# EAGLE design mainboard (EAGLE 9.6.2)
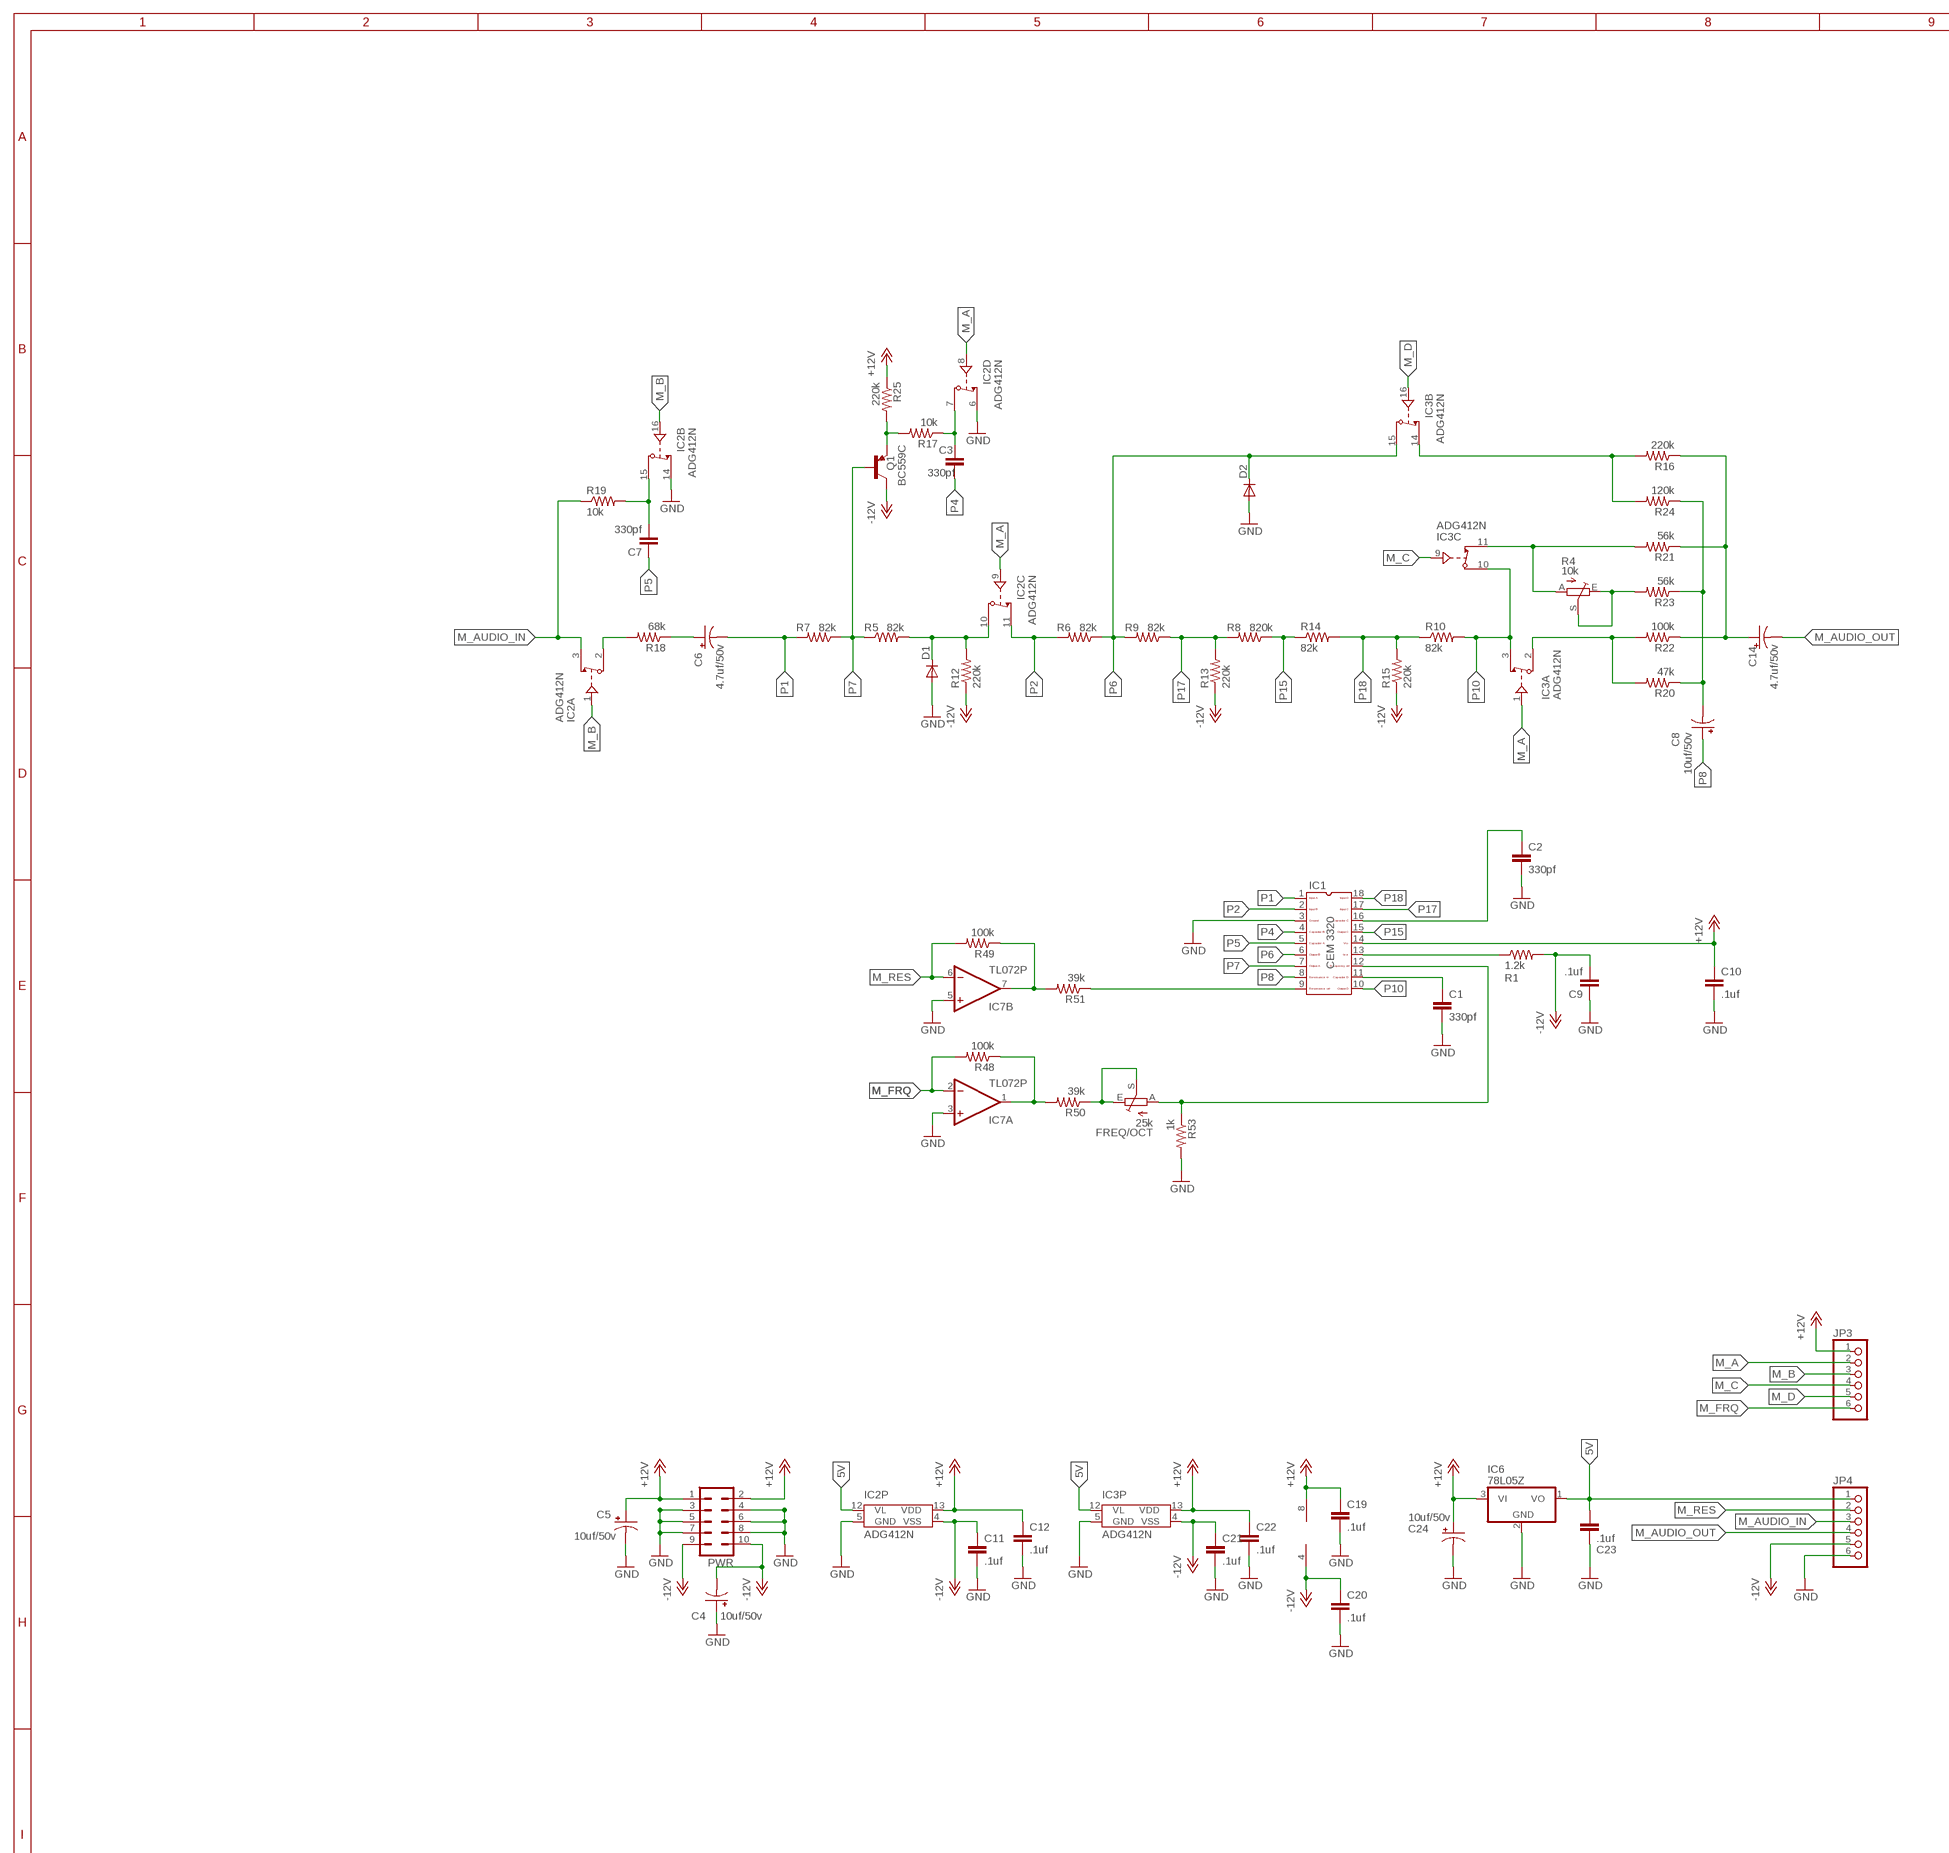
[diagram p0: schematic, sheet 1, part 1 of 2]
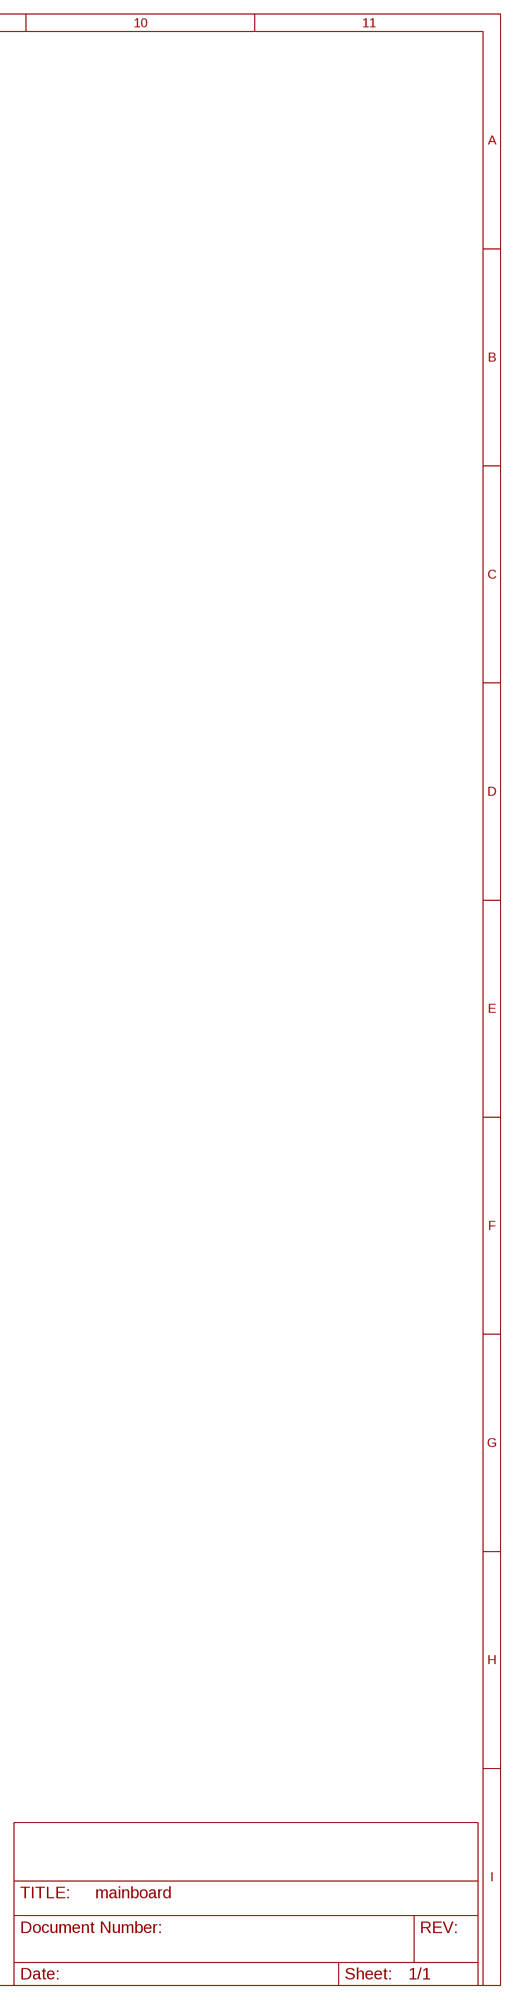
[diagram p1: schematic, sheet 1, part 2 of 2]

## Parts
C1  330pf  C-EU050-050X075  [C050-050X075]
C2  330pf  C-EU050-050X075  [C050-050X075]
C3  330pf  C-EU050-050X075  [C050-050X075]
C4  10uf/50v  CPOL-USE2.5-5  [E2,5-5]
C5  10uf/50v  CPOL-USE2.5-5  [E2,5-5]
C6  4.7uf/50v  CPOL-USE2.5-5  [E2,5-5]
C7  330pf  C-EU050-050X075  [C050-050X075]
C8  10uf/50v  CPOL-USE2.5-5  [E2,5-5]
C9  .1uf  C-EU050-024X044  [C050-024X044]
C10  .1uf  C-EU050-024X044  [C050-024X044]
C11  .1uf  C-EU050-024X044  [C050-024X044]
C12  .1uf  C-EU050-024X044  [C050-024X044]
C14  4.7uf/50v  CPOL-USE2.5-5  [E2,5-5]
C19  .1uf  C-EU050-024X044  [C050-024X044]
C20  .1uf  C-EU050-024X044  [C050-024X044]
C21  .1uf  C-EU050-024X044  [C050-024X044]
C22  .1uf  C-EU050-024X044  [C050-024X044]
C23  .1uf  C-EU050-024X044  [C050-024X044]
C24  10uf/50v  CPOL-USE2.5-5  [E2,5-5]
D1  1N4148DO35-7  [DO35-7]
D2  1N4148DO35-7  [DO35-7]
FREQ/OCT  25k  TRIM_1234-S64YW  [S64YW]
IC1  CEM3320  [DIL18]
IC2  ADG412N  [DIL16]
IC3  ADG412N  [DIL16]
IC6  78L05Z  [TO92]
IC7  TL072P  [DIL08]
JP3  PINHD-1X6  [1X06]
JP4  PINHD-1X6  [1X06]
PWR  ML10  [ML10]
Q1  BC559C  [TO92-EBC]
R1  1.2k  R-US_0207/10  [0207/10]
R4  10k  TRIM_1234-S64YW  [S64YW]
R5  82k  R-US_0207/10  [0207/10]
R6  82k  R-US_0207/10  [0207/10]
R7  82k  R-US_0207/10  [0207/10]
R8  820k  R-US_0207/10  [0207/10]
R9  82k  R-US_0207/10  [0207/10]
R10  82k  R-US_0207/10  [0207/10]
R12  220k  R-US_0207/10  [0207/10]
R13  220k  R-US_0207/10  [0207/10]
R14  82k  R-US_0207/10  [0207/10]
R15  220k  R-US_0207/10  [0207/10]
R16  220k  R-US_0207/10  [0207/10]
R17  10k  R-US_0207/10  [0207/10]
R18  68k  R-US_0207/10  [0207/10]
R19  10k  R-US_0207/10  [0207/10]
R20  47k  R-US_0207/10  [0207/10]
R21  56k  R-US_0207/10  [0207/10]
R22  100k  R-US_0207/10  [0207/10]
R23  56k  R-US_0207/10  [0207/10]
R24  120k  R-US_0207/10  [0207/10]
R25  220k  R-US_0207/10  [0207/10]
R48  100k  R-US_0207/10  [0207/10]
R49  100k  R-US_0207/10  [0207/10]
R50  39k  R-US_0207/10  [0207/10]
R51  39k  R-US_0207/10  [0207/10]
R53  1k  R-US_0207/10  [0207/10]

## Nets
5V: C23.1 IC2.12(P:VL) IC3.12(P:VL) IC6.1(VO) JP4.1
+12V: C5.+ C10.1 C12.1 C19.1 C22.1 C24.+ IC1.14 IC2.13(P:VDD) IC3.13(P:VDD) IC6.3(VI) IC7.8(P:V+) JP3.1 PWR.1 PWR.2 R25.1
-12V: C4.- C9.2 C11.1 C20.1 C21.1 IC2.4(P:VSS) IC3.4(P:VSS) IC7.4(P:V-) JP4.5 PWR.9 PWR.10 Q1.C R1.2 R12.1 R13.1 R15.1
GND: C1.1 C2.2 C4.+ C5.- C9.1 C10.2 C11.2 C12.2 C19.2 C20.2 C21.2 C22.2 C23.2 C24.- D1.A D2.A IC1.3 IC2.5(P:GND) IC2.6(D:S) IC2.14(B:S) IC3.5(P:GND) IC6.2(GND) IC7.3(A:+IN) IC7.5(B:+IN) JP4.6 PWR.3 PWR.4 PWR.5 PWR.6 PWR.7 PWR.8 R53.2
INT_FRQ: FREQ/OCT.A IC1.12 R53.1
INT_RES: IC1.9 R51.1
M_A: IC2.8(D:IN) IC2.9(C:IN) IC3.1(A:IN) JP3.2
M_AUDIO_IN: IC2.3(A:S) JP4.3 R19.1
M_AUDIO_OUT: C14.- JP4.4
M_B: IC2.1(A:IN) IC2.16(B:IN) JP3.3
M_C: IC3.9(C:IN) JP3.4
M_D: IC3.16(B:IN) JP3.5
M_FRQ: IC7.2(A:-IN) JP3.6 R48.2
M_RES: IC7.6(B:-IN) JP4.2 R49.2
N$1: Q1.E R17.2 R25.2
N$2: C6.+ R18.1
N$3: D1.C IC2.10(C:D) R5.2 R12.2
N$4: IC3.2(A:D) R20.2 R22.2
N$5: IC2.2(A:D) R18.2
N$6: C7.2 IC2.15(B:D) R19.2
N$7: R4.E R4.S R23.2
N$9: C3.1 IC2.7(D:D) R17.1
N$10: C14.+ R16.1 R21.1 R22.1
N$11: IC3.11(C:S) R4.A R21.2
N$12: IC3.14(B:S) R16.2 R24.2
N$13: C8.- R20.1 R23.1 R24.1
N$26: C2.1 IC1.16
N$29: IC1.13 R1.1
N$32: C1.2 IC1.11
N$51: FREQ/OCT.E FREQ/OCT.S R50.1
N$52: IC7.7(B:OUT) R49.1 R51.2
N$55: IC7.1(A:OUT) R48.1 R50.2
P1: C6.- IC1.1 R7.2
P2: IC1.2 IC2.11(C:S) R6.2
P4: C3.2 IC1.4
P5: C7.1 IC1.5
P6: D2.C IC1.6 IC3.15(B:D) R6.1 R9.2
P7: IC1.7 Q1.B R5.1 R7.1
P8: C8.+ IC1.8
P10: IC1.10 IC3.3(A:S) IC3.10(C:D) R10.2
P15: IC1.15 R8.1 R14.1
P17: IC1.17 R8.2 R9.1 R13.2
P18: IC1.18 R10.1 R14.2 R15.2
Unconnected: FREQ/OCT.S@1(S) IC3.6(D:S) IC3.7(D:D) IC3.8(D:IN) R4.S@1(S)

## Library data of the parts
C1-C3 C7 = rcl:C-EU: CAPACITOR, European symbol; SPICEPREFIX: C
C4-C6 C8 C14 C24 = resistor:CPOL-US: POLARIZED CAPACITOR, American symbol
C9-C12 C19-C23 = resistor:C-EU: CAPACITOR, European symbol
D1 D2 = diode:1N4148: DIODE high speed (Philips)
FREQ/OCT R4 = pot:TRIM_1234-: POTENTIOMETER
IC1 = CEM:CEM3320: CEM 3330 VCF
IC2 IC3 = analog-devices:ADG412: LC2MOS Precision Quad SPST Switches Source: http://www.analog.com/static/imported-files/data_sheets/ADG411_412_413.pdf; MF: ALTERA CORPORATION; MPN: ADG412TQ; OC_FARNELL: 1438704; OC_NEWARK: 09B7025
IC6 = linear:78*: Positive VOLTAGE REGULATOR Source: http://cache.national.com/ds/LM/LM78L05.pdf http://www.fairchildsemi.com/ds/LM/LM7805.pdf
IC7 = TomW:TL072: OP AMP
JP3 JP4 = pinhead:PINHD-1X6: PIN HEADER
PWR = con-ml:ML10: HARTING; OC_FARNELL: unknown; OC_NEWARK: unknown
Q1 = transistor-pnp:BC559*: PNP Transistror
R1 R5-R10 R12-R25 R48-R51 R53 = resistor:R-US_: RESISTOR, American symbol

## Board
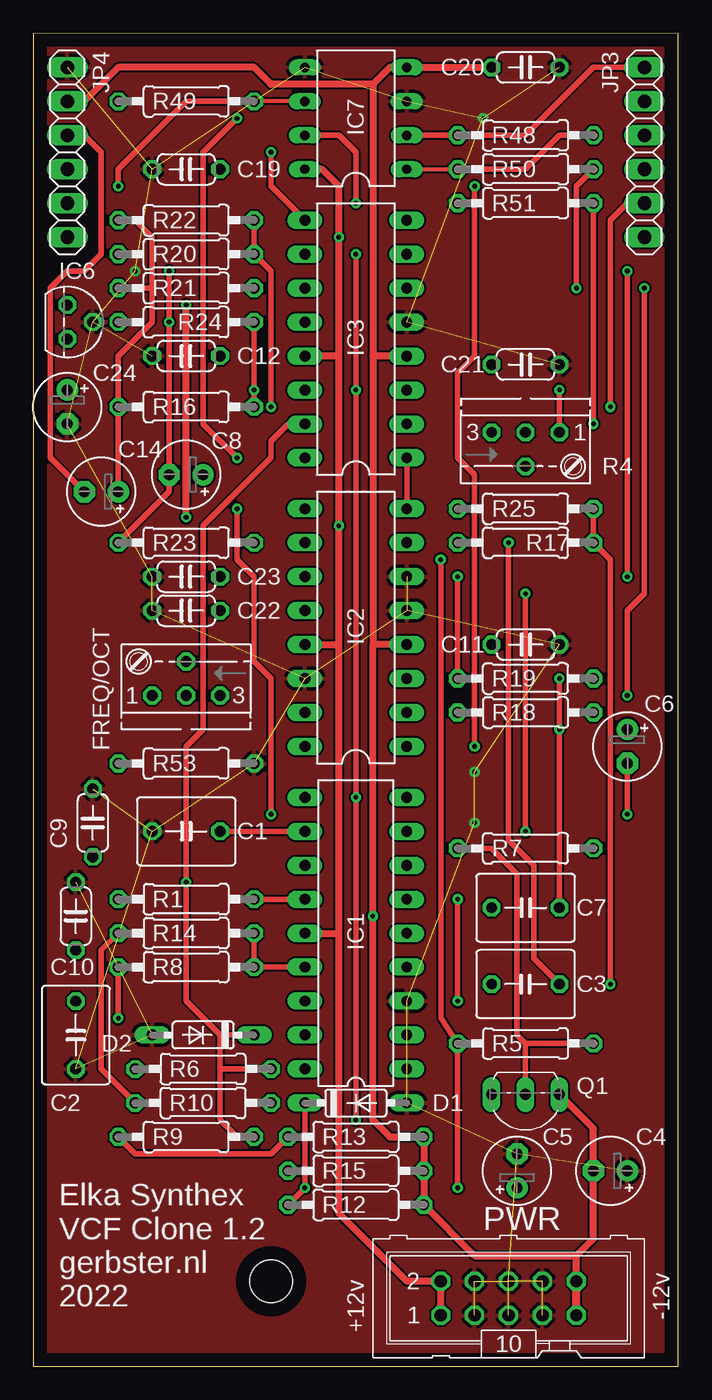
[diagram p2: board, top side]
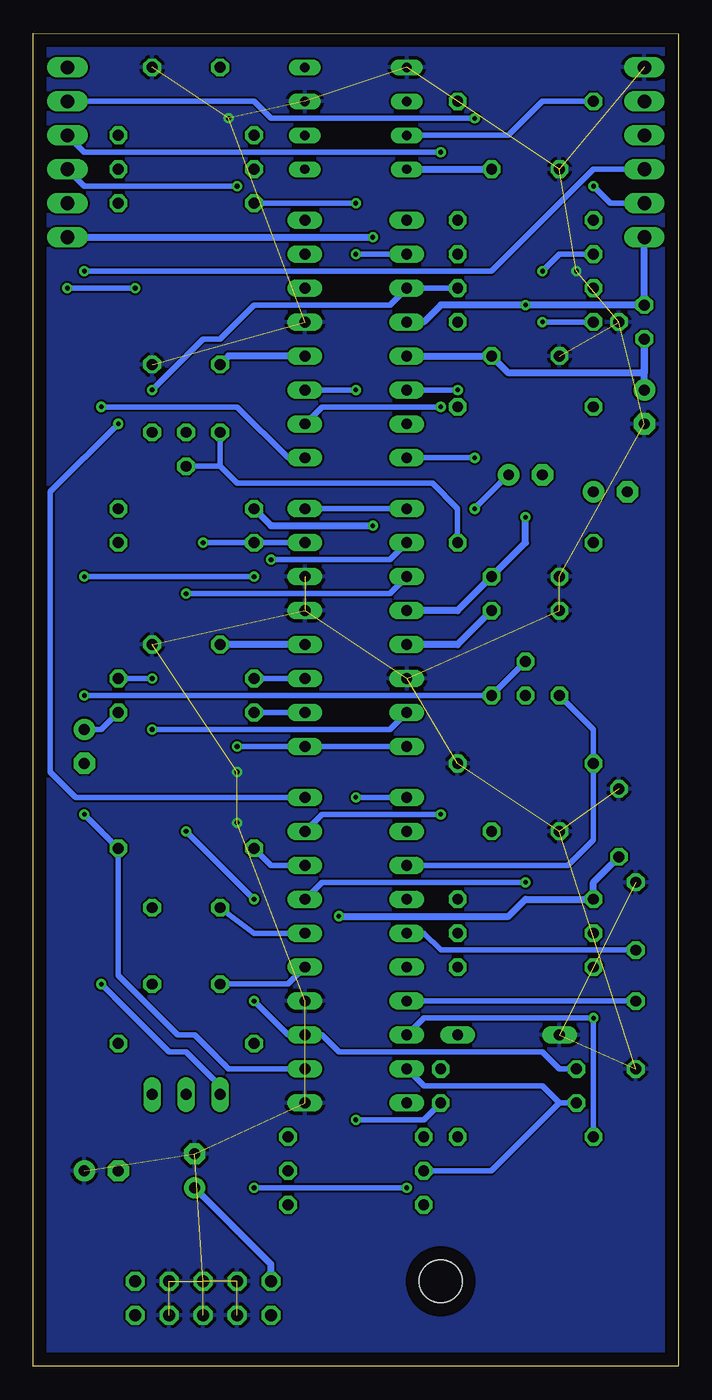
[diagram p3: board, bottom side, seen from below]

Size 48.26 x 99.69 mm. Coordinates in mm from the lower left corner, seen from the top.
Outline: 0,0 48.26,0 48.26,99.69 0,99.69 0,0
Copper layers (1*16): Top 0.035mm / dielectric 1.5mm / Bottom 0.035mm
Design rules "default": minimum track width 6mil, minimum drill 0.35mm, track to track 6mil, track to pad 6mil, pad to pad 6mil, via to via 6mil, smd to smd 6mil, copper to edge 40mil, drill to drill 6mil, minimum pad ring 10mil, minimum via ring 8mil, stop-mask expansion 4mil, vias tented up to drill 0mil, thermal gap 10mil
Holes 3.2 mm at 17.78,6.35

### Footprints (pad centres in the part's own frame; a part is rotated, then mirrored left to right if it is on the bottom)
C050-050X075 = drill 0.813 octagon: 1 -2.54,0; 2 2.54,0
E2,5-5 = drill 0.813 pad 1.6: + -1.27,0 | drill 0.813 pad 1.6 octagon: - 1.27,0
C050-024X044 = drill 0.813 octagon: 1 -2.54,0; 2 2.54,0
DO35-7 = drill 0.813 long: A 3.81,0; C -3.81,0
S64YW = drill 0.813 octagon: A 2.54,1.27; E -2.54,1.27; S 0,-1.27; S@1 0,1.27
DIL18 = drill 0.813 long: 1 -10.16,-3.81; 2 -7.62,-3.81; 3 -5.08,-3.81; 4 -2.54,-3.81; 5 0,-3.81; 6 2.54,-3.81; 7 5.08,-3.81; 8 7.62,-3.81; 9 10.16,-3.81; 10 10.16,3.81; 11 7.62,3.81; 12 5.08,3.81; 13 2.54,3.81; 14 0,3.81; 15 -2.54,3.81; 16 -5.08,3.81; 17 -7.62,3.81; 18 -10.16,3.81
DIL16 = drill 0.813 long: 1 -8.89,-3.81; 2 -6.35,-3.81; 3 -3.81,-3.81; 4 -1.27,-3.81; 5 1.27,-3.81; 6 3.81,-3.81; 7 6.35,-3.81; 8 8.89,-3.81; 9 8.89,3.81; 10 6.35,3.81; 11 3.81,3.81; 12 1.27,3.81; 13 -1.27,3.81; 14 -3.81,3.81; 15 -6.35,3.81; 16 -8.89,3.81
TO92 = drill 0.813 octagon: 1 -1.27,0; 2 0,1.905; 3 1.27,0
DIL08 = drill 0.7 long: 1 -3.81,-3.81; 2 -1.27,-3.81; 3 1.27,-3.81; 4 3.81,-3.81; 5 3.81,3.81; 6 1.27,3.81; 7 -1.27,3.81; 8 -3.81,3.81
1X06 = drill 1.016 long: 1 -6.35,0; 2 -3.81,0; 3 -1.27,0; 4 1.27,0; 5 3.81,0; 6 6.35,0
ML10 = drill 0.914 octagon: 1 -5.08,-1.27; 2 -5.08,1.27; 3 -2.54,-1.27; 4 -2.54,1.27; 5 0,-1.27; 6 0,1.27; 7 2.54,-1.27; 8 2.54,1.27; 9 5.08,-1.27; 10 5.08,1.27
TO92-EBC = drill 0.813 long: B 0,-1.27; C -2.54,-1.27; E 2.54,-1.27
0207/10 = drill 0.813 octagon: 1 -5.08,0; 2 5.08,0

### Placement (x,y rotation side)
C1  11.43,40.01 0 top
C2  3.17,24.77 270 top
C3  36.83,28.57 180 top
C4  43.18,14.61 180 top
C5  36.2,14.61 90 top
C6  44.45,46.35 270 top
C7  36.83,34.29 0 top
C8  11.43,66.67 180 top
C9  4.45,40.64 270 top
C10  3.17,33.66 90 top
C11  36.83,53.98 0 top
C12  11.43,75.56 180 top
C14  5.08,65.41 180 top
C19  11.43,89.53 180 top
C20  36.83,97.16 0 top
C21  36.83,74.93 0 top
C22  11.43,56.52 180 top
C23  11.43,59.05 180 top
C24  2.54,71.75 270 top
D1  24.13,19.68 0 top
D2  12.7,24.77 180 top
FREQ/OCT  11.43,51.44 180 top
IC1  24.13,32.38 90 top
IC2  24.13,55.24 90 top
IC3  24.13,76.83 90 top
IC6  2.54,78.11 270 top
IC7  24.13,93.34 90 top
JP3  45.72,90.81 90 top
JP4  2.54,90.81 90 top
PWR  35.56,5.08 0 top
Q1  36.83,19.05 180 top
R1  11.43,34.92 180 top
R4  36.83,68.58 0 top
R5  36.83,24.13 180 top
R6  12.7,22.23 180 top
R7  36.83,38.73 0 top
R8  11.43,29.84 180 top
R9  11.43,17.14 0 top
R10  12.7,19.68 0 top
R12  24.13,12.06 180 top
R13  24.13,17.14 180 top
R14  11.43,32.38 180 top
R15  24.13,14.61 180 top
R16  11.43,71.75 0 top
R17  36.83,61.59 0 top
R18  36.83,48.9 180 top
R19  36.83,51.44 0 top
R20  11.43,83.19 0 top
R21  11.43,80.64 0 top
R22  11.43,85.72 0 top
R23  11.43,61.59 0 top
R24  11.43,78.11 0 top
R25  36.83,64.14 0 top
R48  36.83,92.08 180 top
R49  11.43,94.61 0 top
R50  36.83,89.53 180 top
R51  36.83,87 180 top
R53  11.43,45.09 0 top

### Tracks (layer width: path | path; a pad name or v marks a point on that pad's centre or on a via)
5V  (via drill 0.35)
  Top 0.508: v11.43,63.5 v11.43,79.38
  Bottom 0.508: JP4.1 IC6.1 v11.43,79.38 17.78,79.38 19.05,78.11 IC3.12 | IC2.12 16.51,56.52 C23.1 11.43,61.59 v11.43,63.5
+12V  (via drill 0.35)
  Top 0.508: PWR.1 PWR.2 27.94,6.35 22.86,11.43 22.86,32.38 | IC2.13 22.86,53.98 | 22.86,32.38 22.86,53.98 | IC1.14 22.86,32.38 | 22.86,53.98 v22.86,62.87 22.86,75.56 | 22.86,75.56 IC3.13 | 22.86,75.56 v22.86,84.45 22.86,88.27 21.59,89.53 IC7.8
  Bottom 0.406: IC1.14 19.05,32.38 17.78,31.11 C10.1
  Bottom 0.508: PWR.2 30.48,7.62 C5.+ | JP3.1 v22.86,84.45 | IC7.8 C19.1 | IC3.13 C12.1 12.7,74.3 2.54,74.3 IC6.3 C24.+ | C22.1 16.51,53.98 IC2.13 | R25.1 30.48,62.87 v22.86,62.87
-12V  (via drill 0.35)
  Top 0.508: 25.4,95.89 26.67,97.16 IC7.4 C20.1 | 25.4,95.89 25.4,75.56 | 25.4,75.56 25.4,53.98 | IC3.4 25.4,75.56 | 40.64,8.26 33.02,8.26 R12.1 R15.1 R13.1 26.67,17.14 25.4,18.41 v25.4,33.66 25.4,53.98 | 40.64,8.26 41.91,9.53 C4.- 41.91,17.78 Q1.C | PWR.10 40.64,8.26 | 25.4,95.89 17.78,95.89 16.51,97.16 6.35,97.16 3.81,94.61 JP4.5 | IC2.4 25.4,53.98
  Top 0.61: PWR.9 PWR.10
  Bottom 0.508: IC2.4 C11.1 | C21.1 33.66,75.56 IC3.4 | v25.4,33.66 12.7,33.66 11.43,34.92 R1.2 6.35,36.2 C9.2
GND  (via drill 0.35)  (35 unrouted)
  other vias: 33.66,93.34 7.62,81.92 33.02,44.45 33.02,40.64
  pour Top: 0,99.69 0,0 48.26,0 48.26,99.69
  pour Bottom: 0,99.69 0,0 48.26,0 48.26,99.69
INT_FRQ
  Bottom 0.406: FREQ/OCT.A 6.35,47.62 R53.1 6.35,39.37 8.26,37.47 IC1.12
INT_RES  (via drill 0.35)
  Top 0.406: v41.91,70.48 R51.1
  Bottom 0.406: IC1.9 45.09,42.55 46.99,44.45 46.99,65.41 v41.91,70.48
M_A  (via drill 0.35)
  Top 0.406: IC3.1 IC2.8 | v43.18,71.75 43.18,85.72 44.45,87 JP3.2
  Bottom 0.406: IC2.8 IC2.9 | IC3.1 29.21,67.94 33.02,71.75 v43.18,71.75
M_AUDIO_IN  (via drill 0.35)
  Top 0.406: v44.45,81.92 v44.45,59.05 | v31.75,59.05 R19.1
  Bottom 0.406: JP4.3 6.35,89.53 13.97,81.92 v44.45,81.92 | v44.45,59.05 v31.75,59.05 | R19.1 IC2.3
M_AUDIO_OUT
  Top 0.406: C14.- 1.27,67.94 1.27,80.64 2.54,81.92 3.81,81.92 5.08,83.19 5.08,90.81 3.81,92.08 JP4.4
M_B  (via drill 0.35)
  Top 0.406: v33.02,88.27 33.02,75.56 31.75,74.3 31.75,67.94 33.02,66.67 v33.02,46.35
  Bottom 0.406: JP3.3 44.45,88.27 v33.02,88.27 | v33.02,46.35 IC2.1 IC2.16
M_C  (via drill 0.35)
  Top 0.406: IC3.9 17.78,88.27 v17.78,90.81
  Bottom 0.406: JP3.4 44.45,90.81 v17.78,90.81
M_D  (via drill 0.35)
  Top 0.406: v15.24,93.34 12.7,90.81 12.7,70.48 v15.24,67.94
  Bottom 0.406: JP3.5 31.75,94.61 30.48,93.34 v15.24,93.34 | v15.24,67.94 IC3.16
M_FRQ
  Top 0.406: IC7.2 R48.2 36.83,92.08 41.91,97.16 JP3.6
M_RES  (via drill 0.35)
  Top 0.305: IC7.6 R49.2
  Top 0.406: v6.35,88.27 6.35,89.53 11.43,94.61 R49.2
  Bottom 0.406: JP4.2 5.08,87 v6.35,88.27
N$1  (via drill 0.35)
  Top 0.406: v43.18,28.57 43.18,60.33 R17.2 R25.2
  Bottom 0.406: Q1.E 34.29,20.95 36.83,23.5 38.1,23.5 v43.18,28.57
N$2
  Bottom 0.406: C6.+ 43.18,47.62 R18.1
N$3  (via drill 0.35)
  Top 0.406: R12.2 v20.32,13.34 D1.C | v31.75,13.34 R5.2 30.48,26.04 v30.48,60.33
  Bottom 0.406: v31.75,13.34 v20.32,13.34 | v30.48,60.33 21.59,60.33 IC2.10
N$4  (via drill 0.35)
  Top 0.406: R22.2 R20.2 17.78,81.92 v17.78,71.75
  Bottom 0.406: v17.78,71.75 26.67,71.75 IC3.2
N$5
  Bottom 0.406: IC2.2 R18.2
N$6  (via drill 0.35)
  Top 0.406: v39.37,51.44 v39.37,47.62 C7.2
  Bottom 0.406: IC2.15 21.59,47.62 v39.37,47.62 | v39.37,51.44 R19.2
N$7
  Bottom 0.406: R4.E 34.29,67.31 | 34.29,67.31 33.02,66.04 18.41,66.04 16.51,64.14 R23.2 | 34.29,67.31 R4.S
N$9  (via drill 0.35)
  Top 0.406: v35.56,61.59 35.56,39.37 37.47,37.47 37.47,30.48 C3.1
  Bottom 0.406: IC2.7 R17.1 v35.56,61.59
N$10
  Top 0.406: R22.1 7.62,85.72 8.89,84.45 8.89,80.64 | C14.+ R16.1 6.35,75.56 8.89,78.11 8.89,80.64 | 8.89,80.64 R21.1
N$11  (via drill 0.35)
  Top 0.406: v39.37,73.03 R4.A
  Bottom 0.406: v39.37,73.03 35.56,76.83 34.29,76.83 31.75,79.38 21.59,79.38 IC3.11 R21.2
N$12  (via drill 0.35)
  Top 0.406: R24.2 v16.51,73.03 R16.2
  Bottom 0.406: v16.51,73.03 IC3.14
N$13  (via drill 0.35)
  Top 0.406: R23.1 10.16,65.41 C8.- v10.16,78.11 v10.16,81.92
  Bottom 0.406: R24.1 v10.16,78.11 | R20.1 8.89,83.19 v10.16,81.92
N$26
  Bottom 0.406: C2.1 IC1.16
N$29
  Top 0.406: R1.1 IC1.13
N$32
  Top 0.406: IC1.11 C1.2
N$51  (via drill 0.35)
  Top 0.406: R50.1 40.64,88.27 v40.64,80.64 | v45.72,80.64 45.72,57.78 44.45,56.52 v44.45,50.16
  Bottom 0.406: FREQ/OCT.S FREQ/OCT.E v44.45,50.16 | v40.64,80.64 v45.72,80.64
N$52  (via drill 0.35)
  Top 0.406: IC7.7 22.86,92.08 24.13,90.81 v24.13,87
  Bottom 0.406: R49.1 10.16,94.61 12.7,92.08 IC7.7 | v24.13,87 R51.2
N$55
  Top 0.305: IC7.1 R50.2
  Top 0.406: R50.2 36.83,89.53 39.37,92.08 R48.1
P1  (via drill 0.35)
  Top 0.406: C6.- v44.45,41.27
  Bottom 0.406: v44.45,41.27 R7.2 41.91,29.21 37.47,24.77 36.2,24.77 33.66,22.23 IC1.1
P2  (via drill 0.35)
  Top 0.406: v36.83,57.78 v36.83,40.01 | v31.75,34.92 v31.75,27.3
  Bottom 0.406: R6.2 8.89,22.23 10.16,23.5 25.4,23.5 26.67,24.77 IC1.2 29.21,24.77 v31.75,27.3 | IC2.11 21.59,57.78 v36.83,57.78 | v36.83,40.01 v31.75,34.92
P4
  Bottom 0.406: IC1.4 29.21,28.57 C3.2
P5
  Bottom 0.406: C7.1 31.75,32.38 IC1.5
P6  (via drill 0.35)
  Top 0.406: R9.2 15.24,17.14 13.97,18.41 13.97,22.23 | 13.97,22.23 R6.1 | 13.97,24.77 13.97,22.23 | D2.C 13.97,24.77 | 13.97,24.77 11.43,27.3 v11.43,36.2 11.43,46.35 12.7,47.62 12.7,62.87 17.78,67.94 17.78,69.22 19.05,70.48 IC3.15
  Bottom 0.406: v11.43,36.2 26.67,36.2 IC1.6
P7
  Top 0.406: 36.83,24.13 Q1.B | R5.1 36.83,24.13 | 36.83,24.13 36.2,24.77 36.2,36.83 34.29,38.73 R7.1
  Bottom 0.406: IC1.7 30.48,37.47 R7.1
P8  (via drill 0.35)
  Top 0.406: v15.24,64.14 15.24,60.33 16.51,59.05 16.51,52.7 17.78,51.44 v17.78,41.27
  Bottom 0.406: C8.+ v15.24,64.14 | v17.78,41.27 26.67,41.27 IC1.8
P10  (via drill 0.35)
  Top 0.406: v24.13,83.19 v24.13,73.03 v24.13,42.55 v24.13,18.41
  Bottom 0.406: IC3.10 v24.13,83.19 | v24.13,73.03 IC3.3 | v24.13,42.55 IC1.10 | v24.13,18.41 19.05,18.41 R10.2
P15
  Top 0.406: IC1.15 R8.1 R14.1
P17  (via drill 0.35)
  Top 0.406: R8.2 v6.35,26.04 | R9.1 7.62,15.88 17.78,15.88 R13.2
  Bottom 0.406: R9.1 v6.35,26.04 19.05,26.04 IC1.17
P18
  Top 0.406: R14.2 5.08,31.11 5.08,22.23 R10.1
  Bottom 0.406: R10.1 8.89,19.68 | R15.2 13.97,14.61 8.89,19.68 | IC1.18 19.05,20.95 10.16,20.95 8.89,19.68

### Text on the board
tNames: -12v | Elka Synthex / VCF Clone 1.2 / gerbster.nl / 2022 | +12v